# Altium schematic sheet decawave-rf.SchDoc
size A
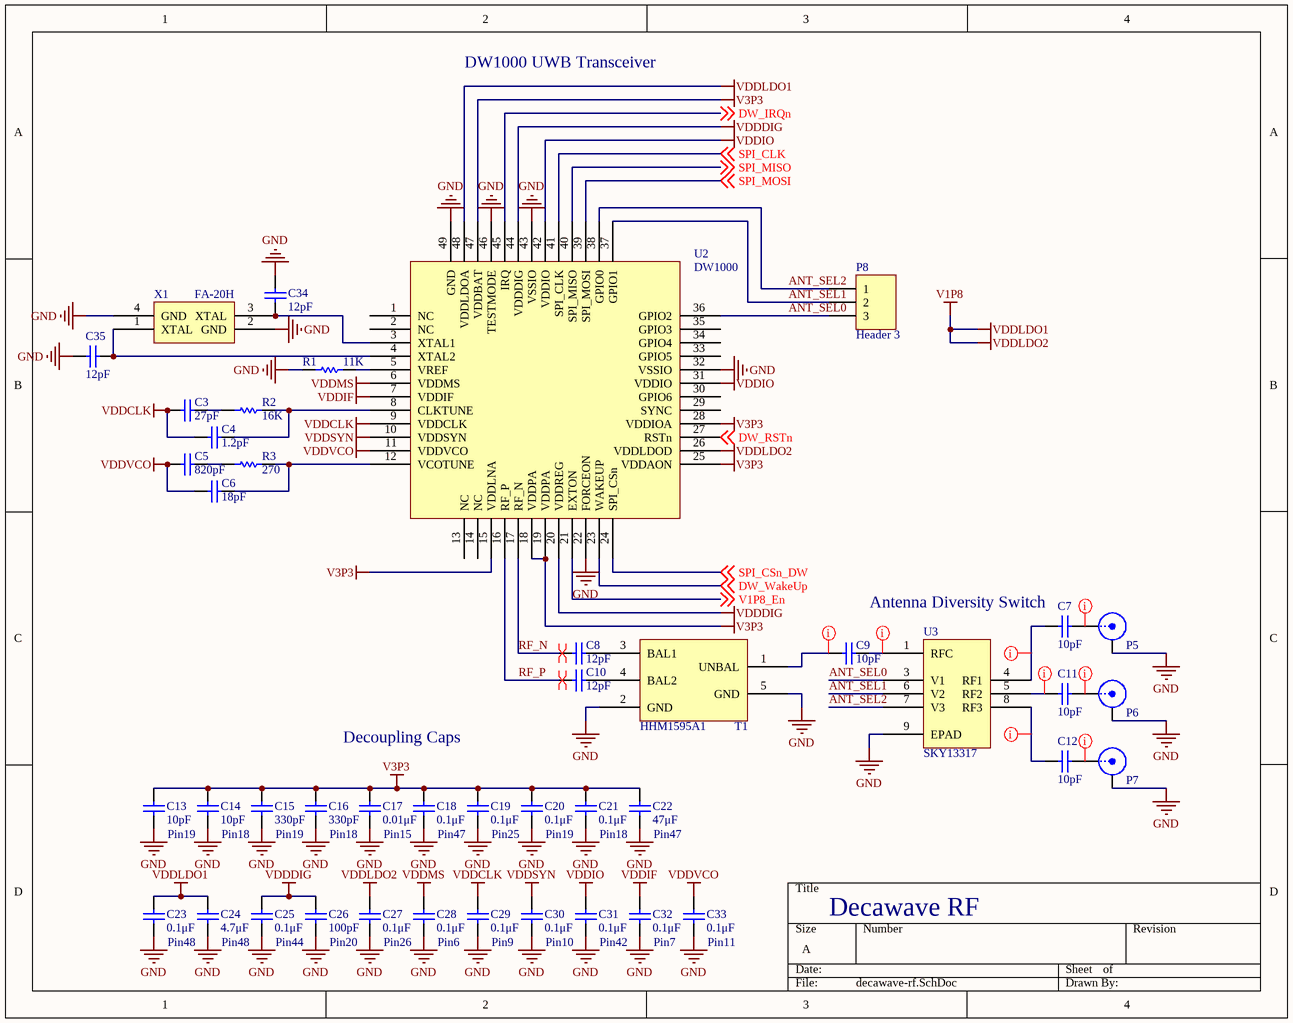
[diagram p0: decawave-rf.SchDoc]

## Parts
C3  value 27pF  [0402]  (hidden comment: Cap Chip)
C4  value 1.2pF  [0402]  (hidden comment: Cap Chip)
C5  value 820pF  [0402]  (hidden comment: Cap Chip)
C6  value 18pF  [0402]  (hidden comment: Cap Chip)
C7  value 10pF  [0402]  (hidden comment: Cap Chip)
C8  value 12pF  [0402]  (hidden comment: Cap Chip)
C9  value 10pF  [0402]  (hidden comment: Cap Chip)
C10  value 12pF  [0402]  (hidden comment: Cap Chip)
C11  value 10pF  [0402]  (hidden comment: Cap Chip)
C12  value 10pF  [0402]  (hidden comment: Cap Chip)
C13  value 10pF  PinPlacement: Pin19  [0402]  (hidden comment: Cap Chip)
C14  value 10pF  PinPlacement: Pin18  [0402]  (hidden comment: Cap Chip)
C15  value 330pF  PinPlacement: Pin19  [0402]  (hidden comment: Cap Chip)
C16  value 330pF  PinPlacement: Pin18  [0402]  (hidden comment: Cap Chip)
C17  value 0.01μF  PinPlacement: Pin15  [0402]  (hidden comment: Cap Chip)
C18  value 0.1μF  PinPlacement: Pin47  [0402]  (hidden comment: Cap Chip)
C19  value 0.1μF  PinPlacement: Pin25  [0402]  (hidden comment: Cap Chip)
C20  value 0.1μF  PinPlacement: Pin19  [0402]  (hidden comment: Cap Chip)
C21  value 0.1μF  PinPlacement: Pin18  [0402]  (hidden comment: Cap Chip)
C22  value 47μF  PinPlacement: Pin47  [0805]  (hidden comment: Cap Chip)
C23  value 0.1μF  PinPlacement: Pin48  [0402]  (hidden comment: Cap Chip)
C24  value 4.7μF  PinPlacement: Pin48  [0402]  (hidden comment: Cap Chip)
C25  value 0.1μF  PinPlacement: Pin44  [0402]  (hidden comment: Cap Chip)
C26  value 100pF  PinPlacement: Pin20  [0402]  (hidden comment: Cap Chip)
C27  value 0.1μF  PinPlacement: Pin26  [0402]  (hidden comment: Cap Chip)
C28  value 0.1μF  PinPlacement: Pin6  [0402]  (hidden comment: Cap Chip)
C29  value 0.1μF  PinPlacement: Pin9  [0402]  (hidden comment: Cap Chip)
C30  value 0.1μF  PinPlacement: Pin10  [0402]  (hidden comment: Cap Chip)
C31  value 0.1μF  PinPlacement: Pin42  [0402]  (hidden comment: Cap Chip)
C32  value 0.1μF  PinPlacement: Pin7  [0402]  (hidden comment: Cap Chip)
C33  value 0.1μF  PinPlacement: Pin11  [0402]  (hidden comment: Cap Chip)
C34  value 12pF  [0402]  (hidden comment: Cap Chip)
C35  value 12pF  [0402]  (hidden comment: Cap Chip)
P5  SMA  [SMA_EDGE]  (value not drawn)
P6  SMA  [SMA_EDGE]  (value not drawn)
P7  SMA  [SMA_EDGE]  (value not drawn)
P8  Header 3  [HDR1X3]
R1  value 11K  [0402]  (hidden comment: Res Chip)
R2  value 16K  [0402]  (hidden comment: Res Chip)
R3  value 270  [0402]  (hidden comment: Res Chip)
T1  HHM1595A1  [HHM 0805]
U2  DW1000  [48QFN-EP]
U3  SKY13317  [MLPQ-UT-8]
X1  FA-20H  [FA-20H]

## Nets
GND: C13.2 C14.2 C15.2 C16.2 C17.2 C18.2 C19.2 C20.2 C21.2 C22.2 C23.2 C24.2 C25.2 C26.2 C27.2 C28.2 C29.2 C30.2 C31.2 C32.2 C33.2 C34.1 C35.1 P5.2(Y) P6.2(Y) P7.2(Y) R1.1 T1.2(GND) T1.5(GND) U2.22(FORCEON) U2.32(VSSIO) U2.43(VSSIO) U2.46(TESTMODE) U2.49(GND) U3.9(EPAD) X1.2(GND) X1.4(GND)
V1P8: C23.1 C24.1 C27.1 U2.26(VDDLDOD) U2.48(VDDLDOA)  [also labelled VDDLDO1, VDDLDO2]
V3P3: C13.1 C14.1 C15.1 C16.1 C17.1 C18.1 C19.1 C20.1 C21.1 C22.1 U2.15(VDDLNA) U2.18(VDDPA) U2.19(VDDPA) U2.25(VDDAON) U2.28(VDDIOA) U2.47(VDDBAT)
VDDCLK: C3.1 C4.1 C29.1 U2.9(VDDCLK)
VDDDIG: C25.1 C26.1 U2.20(VDDREG) U2.44(VDDDIG)
VDDIF: C32.1 U2.7(VDDIF)
VDDIO: C31.1 U2.31(VDDIO) U2.42(VDDIO)
VDDMS: C28.1 U2.6(VDDMS)
VDDSYN: C30.1 U2.10(VDDSYN)
VDDVCO: C5.1 C6.1 C33.1 U2.11(VDDVCO)
ANT_SEL0: P8.3 U2.36(GPIO2) U3.3(V1)
ANT_SEL1: P8.2 U2.37(GPIO1) U3.6(V2)
ANT_SEL2: P8.1 U2.38(GPIO0) U3.7(V3)
DW_IRQn: U2.45(IRQ) ; off-sheet DW_IRQn
DW_RSTn: U2.27(RSTn) ; off-sheet DW_RSTn
DW_WakeUp: U2.23(WAKEUP) ; off-sheet DW_WakeUp
RF_N: C8.1 U2.17(RF_N)
RF_P: C10.1 U2.16(RF_P)
SPI_CLK: U2.41(SPI_CLK) ; off-sheet SPI_CLK
SPI_CSn_DW: U2.24(SPI_CSn) ; off-sheet SPI_CSn_DW
SPI_MISO: U2.40(SPI_MISO) ; off-sheet SPI_MISO
SPI_MOSI: U2.39(SPI_MOSI) ; off-sheet SPI_MOSI
V1P8_En: U2.21(EXTON) ; off-sheet V1P8_En
NetC3_2: C3.2 R2.1
NetC4_2: C4.2 R2.2 U2.8(CLKTUNE)
NetC5_2: C5.2 R3.1
NetC6_2: C6.2 R3.2 U2.12(VCOTUNE)
NetC7_1: C7.1 U3.4(RF1)
NetC7_2: C7.2 P5.1(X)
NetC8_2: C8.2 T1.3(BAL1)
NetC9_1: C9.1 T1.1(UNBAL)
NetC9_2: C9.2 U3.1(RFC)
NetC10_2: C10.2 T1.4(BAL2)
NetC11_1: C11.1 U3.5(RF2)
NetC11_2: C11.2 P6.1(X)
NetC12_1: C12.1 U3.8(RF3)
NetC12_2: C12.2 P7.1(X)
NetC34_2: C34.2 U2.3(XTAL1) X1.3(XTAL)
NetC35_2: C35.2 U2.4(XTAL2) X1.1(XTAL)
NetR1_2: R1.2 U2.5(VREF)

Not connected (* = marked no-connect by the designer): U2 1(NC) 2(NC) 13(NC) 14(NC) 29(SYNC) 30(GPIO6) 33(GPIO5) 34(GPIO4) 35(GPIO3)

## Layout directives
differential pair: RF_N, RF_P
net class RF: NetC7_1, NetC7_2, NetC9_1, NetC9_2, NetC11_1, NetC11_2, NetC12_1, NetC12_2

## Notes on the sheet
- DW1000 UWB Transceiver
- (near C7) Antenna Diversity Switch
- Decoupling Caps
- Decawave RF

## Library data of the parts
C3 = Cap Chip: Capacitor (Semiconductor SIM Model); DistPartNo: 490-5869-1-ND; ManPartNo: GRM1555C1H270JA01D; Published: 8-Jun-2000; LatestRevisionDate: 29-May-2009; LatestRevisionNote: IPC-7351 Footprint Added.; PackageReference: C1206; Publisher: Altium Limited; PackageDescription: Chip Capacitor
C4 = Cap Chip: Capacitor (Semiconductor SIM Model); DistPartNo: 490-6209-1-ND; ManPartNo: GRM1555C1H1R2BA01D; Published: 8-Jun-2000; LatestRevisionDate: 29-May-2009; LatestRevisionNote: IPC-7351 Footprint Added.; PackageReference: C1206; Publisher: Altium Limited; PackageDescription: Chip Capacitor
C5 = Cap Chip: Capacitor (Semiconductor SIM Model); DistPartNo: 490-3250-1-ND; ManPartNo: GRM155R71H821KA01D; Published: 8-Jun-2000; LatestRevisionDate: 29-May-2009; LatestRevisionNote: IPC-7351 Footprint Added.; PackageReference: C1206; Publisher: Altium Limited; PackageDescription: Chip Capacitor
C6 = Cap Chip: Capacitor (Semiconductor SIM Model); DistPartNo: 490-5858-1-ND; ManPartNo: GRM1555C1H180JA01D; Published: 8-Jun-2000; LatestRevisionDate: 29-May-2009; LatestRevisionNote: IPC-7351 Footprint Added.; PackageReference: C1206; Publisher: Altium Limited; PackageDescription: Chip Capacitor
C7 C9 C11-C14 = Cap Chip: Capacitor (Semiconductor SIM Model); DistPartNo: 490-3113-1-ND; ManPartNo: GJM1555C1H100JB01D; Published: 8-Jun-2000; LatestRevisionDate: 29-May-2009; LatestRevisionNote: IPC-7351 Footprint Added.; PackageReference: C1206; Publisher: Altium Limited; PackageDescription: Chip Capacitor
C8 C10 C34 C35 = Cap Chip: Capacitor (Semiconductor SIM Model); DistPartNo: 490-3115-1-ND; ManPartNo: GJM1555C1H120JB01D; Published: 8-Jun-2000; LatestRevisionDate: 29-May-2009; LatestRevisionNote: IPC-7351 Footprint Added.; PackageReference: C1206; Publisher: Altium Limited; PackageDescription: Chip Capacitor
C15 C16 = Cap Chip: Capacitor (Semiconductor SIM Model); DistPartNo: 490-1295-1-ND; ManPartNo: GRM1555C1H331JA01D; Published: 8-Jun-2000; LatestRevisionDate: 29-May-2009; LatestRevisionNote: IPC-7351 Footprint Added.; PackageReference: C1206; Publisher: Altium Limited; PackageDescription: Chip Capacitor
C17 = Cap Chip: Capacitor (Semiconductor SIM Model); DistPartNo: 490-1312-1-ND; ManPartNo: GRM155R71E103KA01D; Published: 8-Jun-2000; LatestRevisionDate: 29-May-2009; LatestRevisionNote: IPC-7351 Footprint Added.; PackageReference: C1206; Publisher: Altium Limited; PackageDescription: Chip Capacitor
C18-C21 C23 C25 C27-C33 = Cap Chip: Capacitor (Semiconductor SIM Model); DistPartNo: 490-3261-1-ND; ManPartNo: GRM155R71C104KA88D; Published: 8-Jun-2000; LatestRevisionDate: 29-May-2009; LatestRevisionNote: IPC-7351 Footprint Added.; PackageReference: C1206; Publisher: Altium Limited; PackageDescription: Chip Capacitor
C22 = Cap Chip: Capacitor (Semiconductor SIM Model); DistPartNo: 1276-2420-1-ND; ManPartNo: CL21A476MQCLRNC; Published: 8-Jun-2000; LatestRevisionDate: 29-May-2009; LatestRevisionNote: IPC-7351 Footprint Added.; PackageReference: C1206; Publisher: Altium Limited; PackageDescription: Chip Capacitor
C24 = Cap Chip: Capacitor (Semiconductor SIM Model); DistPartNo: 445-8023-1-ND; ManPartNo: C1005X5R1A475M050BC; Published: 8-Jun-2000; LatestRevisionDate: 29-May-2009; LatestRevisionNote: IPC-7351 Footprint Added.; PackageReference: C1206; Publisher: Altium Limited; PackageDescription: Chip Capacitor
C26 = Cap Chip: Capacitor (Semiconductor SIM Model); DistPartNo: 490-5922-1-ND; ManPartNo: GRM1555C1H101JA01D; Published: 8-Jun-2000; LatestRevisionDate: 29-May-2009; LatestRevisionNote: IPC-7351 Footprint Added.; PackageReference: C1206; Publisher: Altium Limited; PackageDescription: Chip Capacitor
P5-P7 = SMA: DistPartNo: CONSMA003.062-ND; ManPartNo: CONSMA003.062
P8 = Header 3: Header, 3-Pin; LatestRevisionDate: 17-Jul-2002; LatestRevisionNote: Re-released for DXP Platform.; Publisher: Altium Limited
R1 = Res Chip: Surface-mount resistor; DistPartNo: P11.0KLCT-ND; ManPartNo: ERJ-2RKF1102X; Published: 8-Jun-2000; LatestRevisionDate: 17-Jul-2002; LatestRevisionNote: Re-released for DXP Platform.; PackageReference: AXIAL-0.5; Publisher: Altium Limited; PackageDescription: Axial Device, Thru-Hole; 2 Leads; 0.5 in Pin Spacing
R2 = Res Chip: Surface-mount resistor; DistPartNo: P16.0KLCT-ND; ManPartNo: ERJ-2RKF1602X; Published: 8-Jun-2000; LatestRevisionDate: 17-Jul-2002; LatestRevisionNote: Re-released for DXP Platform.; PackageReference: AXIAL-0.5; Publisher: Altium Limited; PackageDescription: Axial Device, Thru-Hole; 2 Leads; 0.5 in Pin Spacing
R3 = Res Chip: Surface-mount resistor; DistPartNo: P270LCT-ND; ManPartNo: ERJ-2RKF2700X; Published: 8-Jun-2000; LatestRevisionDate: 17-Jul-2002; LatestRevisionNote: Re-released for DXP Platform.; PackageReference: AXIAL-0.5; Publisher: Altium Limited; PackageDescription: Axial Device, Thru-Hole; 2 Leads; 0.5 in Pin Spacing
T1 = HHM1595A1: UWB Balun; DistPartNo: 445-3387-1-ND; ManPartNo: HHM1595A1
U2 = DW1000: DistPartNo: 1479-1001-1-ND; ManPartNo: DW1000-I-TR13
U3 = SKY13317: SP3T RF Switch; DistPartNo: 863-1056-1-ND; ManPartNo: SKY13317-373LF
X1 = FA-20H: 2.5 mm x 2.0 mm SMD Crystal; DistPartNo: SER3631CT-ND; ManPartNo: FA-20H 38.4000MF10Z-AS3